# Altium schematic sheet Leds.SchDoc
size A4 portrait; SheetNumber: 7; SheetTotal: 8
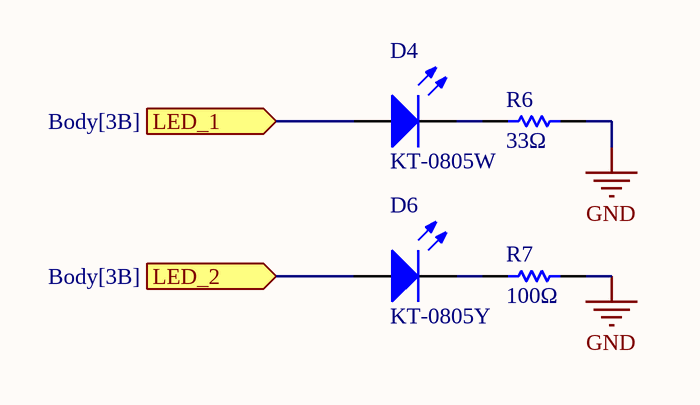
[diagram p0: Leds.SchDoc]

## Parts
D4  KT-0805W  [LED0805]
D6  KT-0805Y  [LED0805]
R6  value 33Ω  [RES0805]  (hidden comment: 0805W8F330JT5E)
R7  value 100Ω  [RES0805]  (hidden comment: 0805W8F1000T5E)

## Ports
LED_1 (in, see Body[3B]), LED_2 (in, see Body[3B])

## Nets
GND: R6.2 R7.2
LED_1: D4.A ; port LED_1
LED_2: D6.A ; port LED_2
NetD4_K: D4.K R6.1
NetD6_K: D6.K R7.1

## Library data of the parts
D4 = KT-0805W: 0805 LED Indication - Discrete ROHS; Manufacturer: Hubei KENTO Elec; Color: White; Current - Forward (If): 25mA; Voltage - Forward (Vf): 2.8V; LCSC: C34499; Package / Case: 0805; ComponentLink2Description: Datasheet; ComponentLink2URL: https://www.lcsc.com/datasheet/lcsc_datasheet_2305091500_Hubei-KENTO-Elec-KT-0805W_C34499.pdf; ComponentLink3Description: JLCPCB; ComponentLink3URL: https://jlcpcb.com/partdetail/Hubei_KentoElec-KT0805W/C34499
D6 = KT-0805Y: Yellow 0805 LED Indication - Discrete ROHS; Manufacturer: Hubei KENTO Elec; Current - Forward (If): 20mA; Voltage - Forward (Vf): 2.1V; LCSC: C2296; Package / Case: 0805; Color: Yellow; ComponentLink2Description: Datasheet; ComponentLink2URL: https://www.lcsc.com/datasheet/lcsc_datasheet_1806151129_Hubei-KENTO-Elec-KT-0805Y_C2296.pdf
R6 = 0805W8F330JT5E: 125mW Thick Film Resistors 150V ±1% ±200ppm/℃ 33Ω 0805 Chip Resistor - Surface Mount ROHS; Manufacturer_Name: UNI-ROYAL; Geometry.Height: 0.95mm; Part Number: 0805W8F330JT5E; LCSC: C17634; ComponentLink1Description: Datasheet Link; ComponentLink1URL: https://www.lcsc.com/datasheet/lcsc_datasheet_2205311830_UNI-ROYAL-Uniroyal-Elec-0805W8F330JT5E_C17634.pdf
R7 = 0805W8F1000T5E: 125mW Thick Film Resistors 150V ±100ppm/℃ ±1% 100Ω 0805 Chip Resistor - Surface Mount ROHS; Manufacturer_Name: UNI-ROYAL; Geometry.Height: 0.95mm; Manufacturer_Part_Number: 0805W8F1000T5E; Datasheet Link: https://wmsc.lcsc.com/wmsc/upload/file/pdf/v2/lcsc/2206010216_UNI-ROYAL-Uniroyal-Elec-0805W8F1000T5E_C17408.pdf; LCSC: C17408